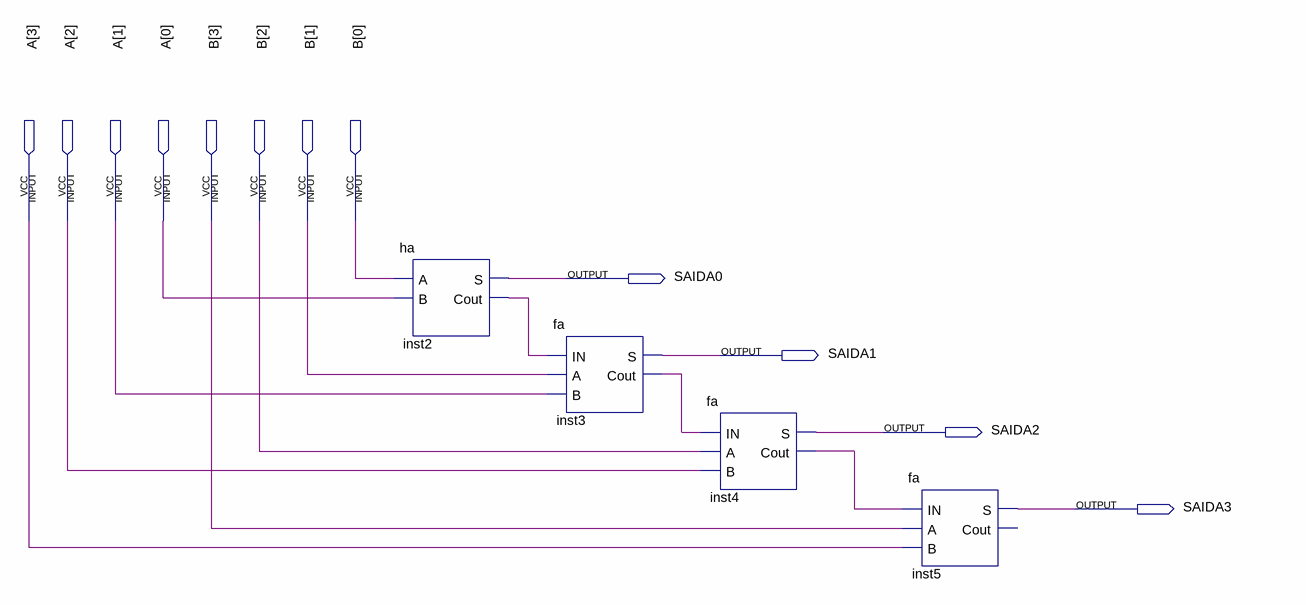
[diagram p0: schematic sheet]
// Quartus schematic adder_c2.bdf as structural Verilog: 4 symbols, 12 pins
module adder_c2 (
  input  [3:0] A,
  input  [3:0] B,
  output SAIDA0,
  output SAIDA1,
  output SAIDA2,
  output SAIDA3
);

  wire inst2_cout, inst3_cout, inst4_cout;

  ha inst2 (.A(B[0]), .B(A[0]), .S(SAIDA0), .Cout(inst2_cout));
  fa inst3 (.IN(inst2_cout), .A(B[1]), .B(A[1]), .S(SAIDA1), .Cout(inst3_cout));
  fa inst4 (.IN(inst3_cout), .A(B[2]), .B(A[2]), .S(SAIDA2), .Cout(inst4_cout));
  fa inst5 (.IN(inst4_cout), .A(B[3]), .B(A[3]), .S(SAIDA3));  // open: Cout
endmodule
